# EAGLE design Croduino Nova (EAGLE 7.3.0)
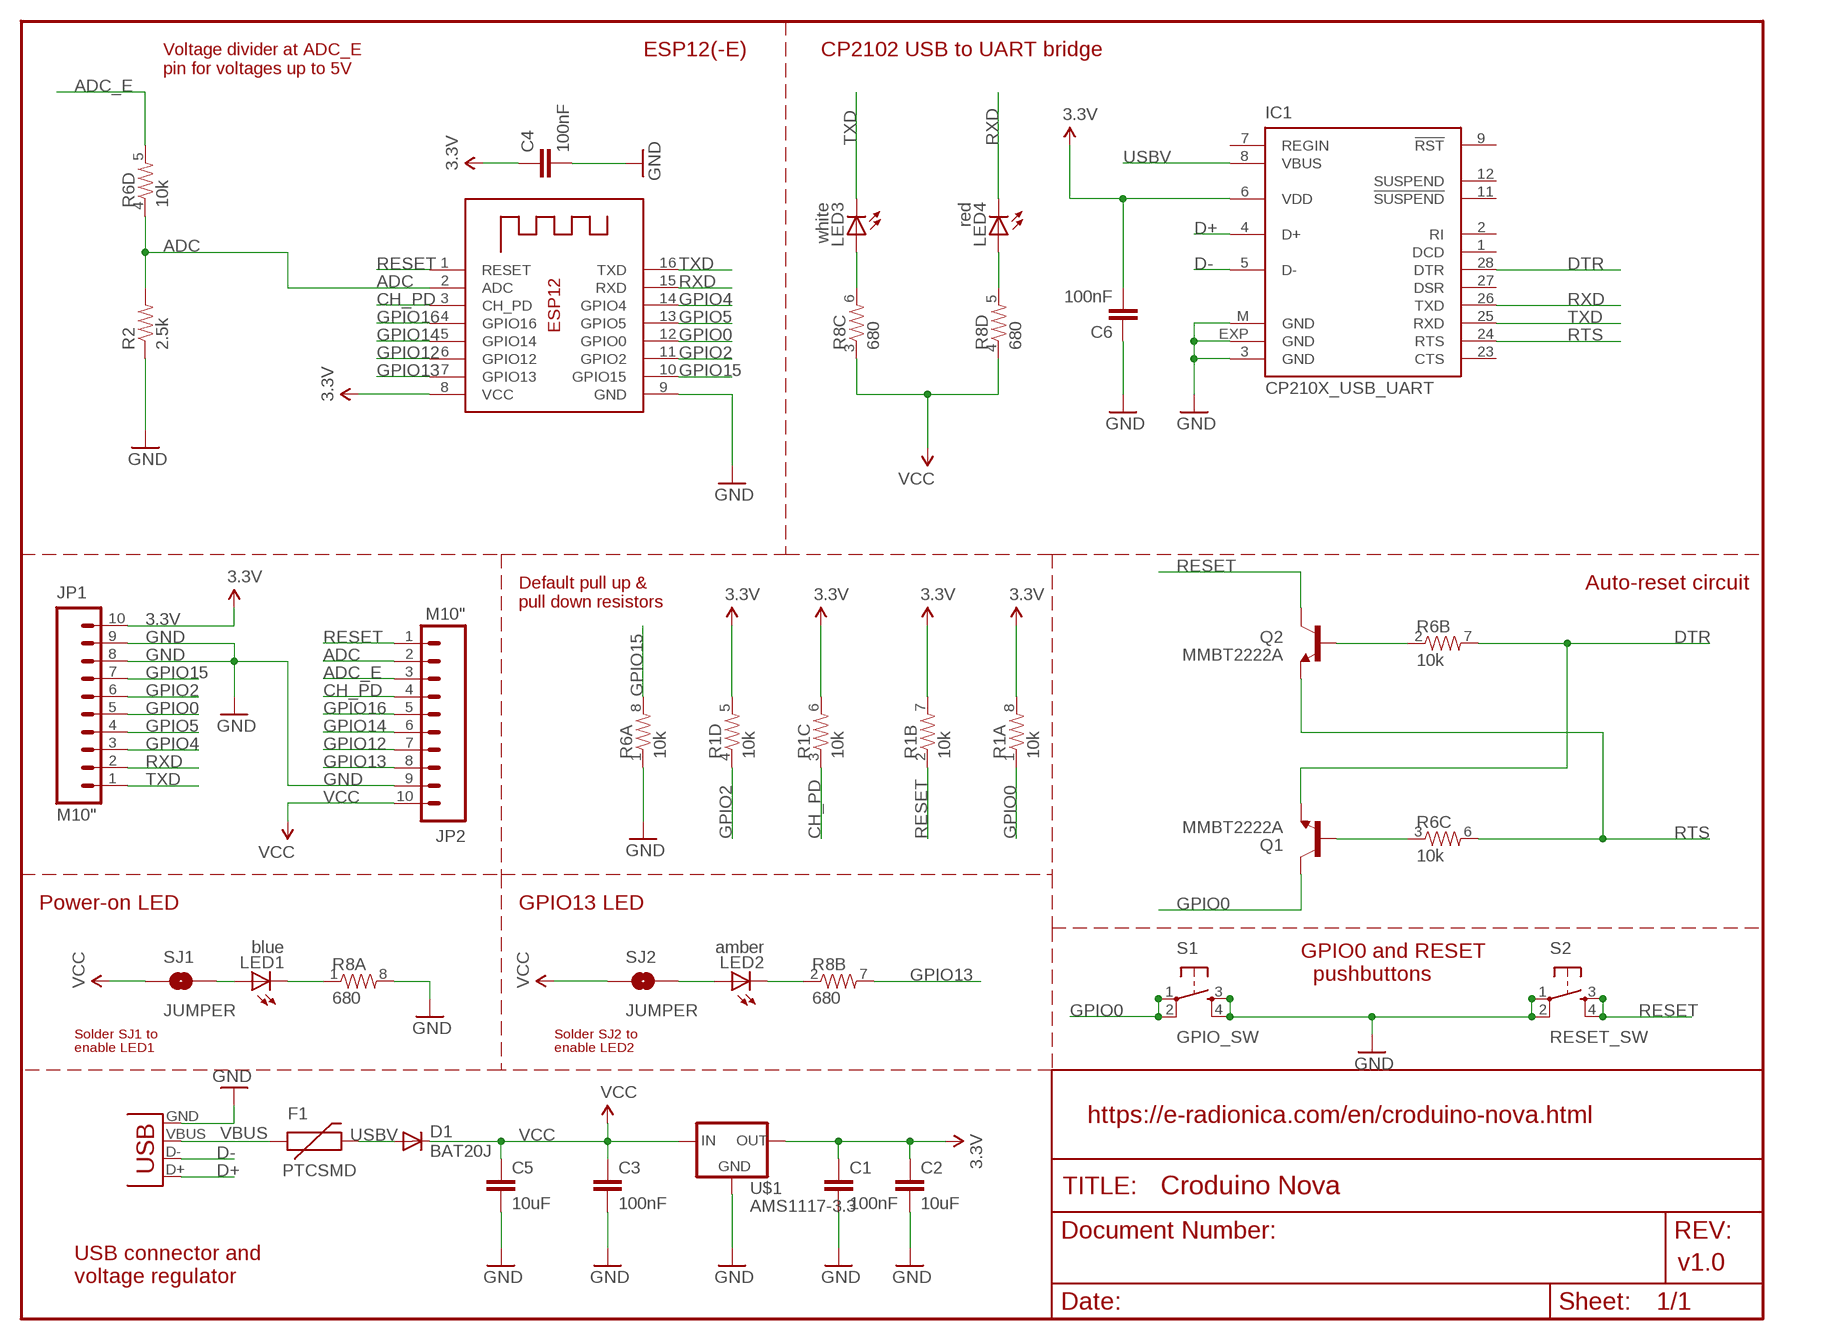
[diagram p0: schematic, sheet 1]

## Parts
C1  100nF  CAP0603-CAP  [0603-CAP]
C2  10uF  CAP1206  [1206]
C3  100nF  CAP0603-CAP  [0603-CAP]
C4  100nF  CAP0603-CAP  [0603-CAP]
C5  10uF  CAP1206  [1206]
C6  100nF  CAP0603-CAP  [0603-CAP]
D1  BAT20J  DIODESOD  [SOD-323]
F1  PTCSMD  [PTC-1206]
IC1  CP210X_USB_UART  [MLP28]
JP1  M10"  [1X10]
JP2  M10"  [1X10]
LED1  blue  LEDCHIP-LED0805  [CHIP-LED0805]
LED2  amber  LEDCHIP-LED0805  [CHIP-LED0805]
LED3  white  LEDCHIP-LED0805  [CHIP-LED0805]
LED4  red  LEDCHIP-LED0805  [CHIP-LED0805]
Q1  MMBT2222A  TRANSISTOR_NPNSOT23-3  [SOT23-3]
Q2  MMBT2222A  TRANSISTOR_NPNSOT23-3  [SOT23-3]
R1  10k  RESISTOR-ARRAY0603-ARV  [0603-ARV]
R2  2.5k  RESISTOR0603-RES  [0603-RES]
R6  10k  RESISTOR-ARRAY0603-ARV  [0603-ARV]
R8  680  RESISTOR-ARRAY0603-ARV  [0603-ARV]
S1  GPIO_SW  TAC_SWITCHSMD  [TACTILE_SWITCH_SMD]
S2  RESET_SW  TAC_SWITCHSMD  [TACTILE_SWITCH_SMD]
SJ1  JUMPER  SOLDERJUMPERNC  [SJ_2S]
SJ2  JUMPER  SOLDERJUMPERNC  [SJ_2S]
U$1  AMS1117-3.3  [SOT223]
X1  ESP8266-12  ESP-12  [ESP-12]
X2  USB-MICROB  [USB-MICROB]

## Nets
3.3V: C1.1 C2.1 C4.1 C6.2 IC1.6(VDD) JP1.10 R1.5 R1.6 R1.7 R1.8 U$1.4(OUT) X1.8(VCC)
ADC: JP2.2 R2.2 R6.4 X1.2(ADC)
ADC_E: JP2.3 R6.5
CH_PD: JP2.4 R1.3 X1.3(CH_PD)
D+: IC1.4(D+) X2.D+
D-: IC1.5(D-) X2.D-
DTR: IC1.28(DTR) Q1.2(E) R6.7
GND: C1.2 C2.2 C3.2 C4.2 C5.2 C6.1 IC1.3(GND) IC1.EXP(GND) IC1.M(GND) JP1.8 JP1.9 JP2.9 R2.1 R6.1 R8.8 S1.3 S1.4 S2.1 S2.2 U$1.1(ADJ) X1.9(GND) X2.GND
GPIO0: JP1.5 Q1.3(C) R1.1 S1.1 S1.2 X1.12(GPIO0)
GPIO2: JP1.6 R1.4 X1.11(GPIO2)
GPIO4: JP1.3 X1.14(GPIO4)
GPIO5: JP1.4 X1.13(GPIO5)
GPIO12: JP2.7 X1.6(GPIO12)
GPIO13: JP2.8 R8.7 X1.7(GPIO13)
GPIO14: JP2.6 X1.5(GPIO14)
GPIO15: JP1.7 R6.8 X1.10(GPIO15)
GPIO16: JP2.5 X1.4(GPIO16)
N$1: LED3.A R8.6
N$2: LED1.A SJ1.2
N$3: LED1.C R8.1
N$4: LED4.A R8.5
N$6: LED2.A SJ2.2
N$7: LED2.C R8.2
N$8: Q1.1(B) R6.3
N$11: Q2.1(B) R6.2
RESET: JP2.1 Q2.3(C) R1.2 S2.3 S2.4 X1.1(RESET)
RTS: IC1.24(RTS) Q2.2(E) R6.6
RXD: IC1.26(TXD) JP1.2 LED4.C X1.15(RXD)
TXD: IC1.25(RXD) JP1.1 LED3.C X1.16(TXD)
USBV: D1.2(A) F1.2 IC1.8(VBUS)
VBUS: F1.1 X2.VBUS
VCC: C3.1 C5.1 D1.1(C) JP2.10 R8.3 R8.4 SJ1.1 SJ2.1 U$1.3(IN)
Unconnected: IC1.1(DCD) IC1.2(RI) IC1.7(REGIN) IC1.9(!RST) IC1.11(!SUSPEND) IC1.12(SUSPEND) IC1.23(CTS) IC1.27(DSR)

## Notes on the sheet
- ESP12(-E) | CP2102 USB to UART bridge
- Voltage divider at ADC_E
  pin for voltages up to 5V
- Auto-reset circuit
- Default pull up &
  pull down resistors
- Power-on LED | GPIO13 LED
- GPIO0 and RESET
    pushbuttons
- Solder SJ1 to 
  enable LED1
- Solder SJ2 to
  enable LED2
- https://e-radionica.com/en/croduino-nova.html
- v1.0
- USB connector and 
  voltage regulator

## Library data of the parts
C1-C6 = SparkFun:CAP: Capacitor Standard 0603 ceramic capacitor, and 0.1" leaded capacitor.
D1 = SparkFun:DIODE: Diode These are standard reverse protection diodes and small signal diodes. SMA package can handle up to about 1A. SOD-323 can handle about 200mA. What the SOD-323 package when ordering, there are some mfgs out there that are 5-pin packages.
F1 = SparkFun:PTC: Resettable Fuse PTC Resettable Fuse. Spark Fun Electronics SKU : COM-08357
IC1 = SparkFun:CP210X_USB_UART: Single-Chip USB to UART Bridge Source: www.silabs.com .. CP2101.pdf / cp2102.pdf. Spark Fun Electronics SKU : COM-00310
JP1 JP2 = SparkFun:M10: Header 10 Standard 10-pin 0.1" header. Use with straight break away headers (SKU : PRT-00116), right angle break away headers (PRT-00553), swiss pins (PRT-00743), machine pins (PRT-00117), and female headers (PRT-00115).
LED1-LED4 = adafruit:LED: LED OSRAM: - CHIPLED LG R971, LG N971, LY N971, LG Q971, LY Q971, LO R971, LY R971 LH N974, LH R974 LS Q976, LO Q976, LY Q976 LO Q996 - Hyper CHIPLED LW Q18S LB Q993, LB Q99A, LB R99A - SideLED LS A670, LO A670, LY A670, LG A670, LP A670 LB A673, LV A673, LT A673, LW A673 LH A674 LY A675 LS A676, LA A676, LO A676, LY A676, LW A676 LS A679, LY A679, LG A679 - Hyper Micro SIDELED® LS Y876, LA Y876, LO Y876, LY Y876 LT Y87S - SmartLED LW L88C, LW L88S LB L89C, LB L89S, LG L890 LS L89K, LO L89K, LY L89K LS L896, LA L896, LO L896, LY L896 - TOPLED LS T670, LO T670, LY T670, LG T670, LP T670 LSG T670, LSP T670, LSY T670, LOP T670, LYG T670 LG T671, LOG T671, LSG T671 LB T673, LV T673, LT T673, LW T673 LH T674 LS T676, LA T676, LO T676, LY T676, LB T676, LH T676, LSB T676, LW T676 LB T67C, LV T67C, LT T67C, LS T67K, LO T67K, LY T67K, LW E67C LS E67B, LA E67B, LO E67B, LY E67B, LB E67C, LV E67C, LT E67C LW T67C LS T679, LY T679, LG T679 LS T770, LO T770, LY T770, LG T770, LP T770 LB T773, LV T773, LT T773, LW T773 LH T774 LS E675, LA E675, LY E675, LS T675 LS T776, LA T776, LO T776, LY T776, LB T776 LHGB T686 LT T68C, LB T68C - Hyper Mini TOPLED® LB M676 - Mini TOPLED Santana® LG M470 LS M47K, LO M47K, LY M47K Source: http://www.osram.convergy.de/
Q1 Q2 = SparkFun:TRANSISTOR_NPN: Transistor NPN BJT configuration in SOT23 package. MMBT2222 is the common NPN we use. Double check BCE configuration again layout.
R1 R6 R8 = SparkFun:RESISTOR-ARRAY: Array Chip Resistor Source: RS Component / Phycomp
R2 = SparkFun:RESISTOR: Resistor Basic schematic elements and footprints for 0603, 1206, and PTH resistors.
S1 S2 = SparkFun:TAC_SWITCH: Momentary Switch Button commonly used for reset or general input. Spark Fun Electronics SKU : COM-00097
SJ1 SJ2 = SparkFun:SOLDERJUMPER: Solder Jumper Standard SMD solder jumper. Used to automate production. Two varients : Normally Open and Normally Closed are the same, but have different paste layers. NC will have a large amount of paste and should jumper during reflow.
U$1 = SparkFun:AMS1117-3.3
X1 = adafruit:ESP-12
X2 = SparkFun:USB: USB Connectors USB-B-PTH is fully proven SKU : PRT-00139 USB-miniB is fully proven SKU : PRT-00587 USB-A-PCB is untested. USB-A-H is throughly reviewed, but untested. Spark Fun Electronics SKU : PRT-00437 USB-B-SMT is throughly reviewed, but untested. Needs silkscreen touching up. USB-A-S has not been used/tested USB-MB-H has not been used/tested

## Board
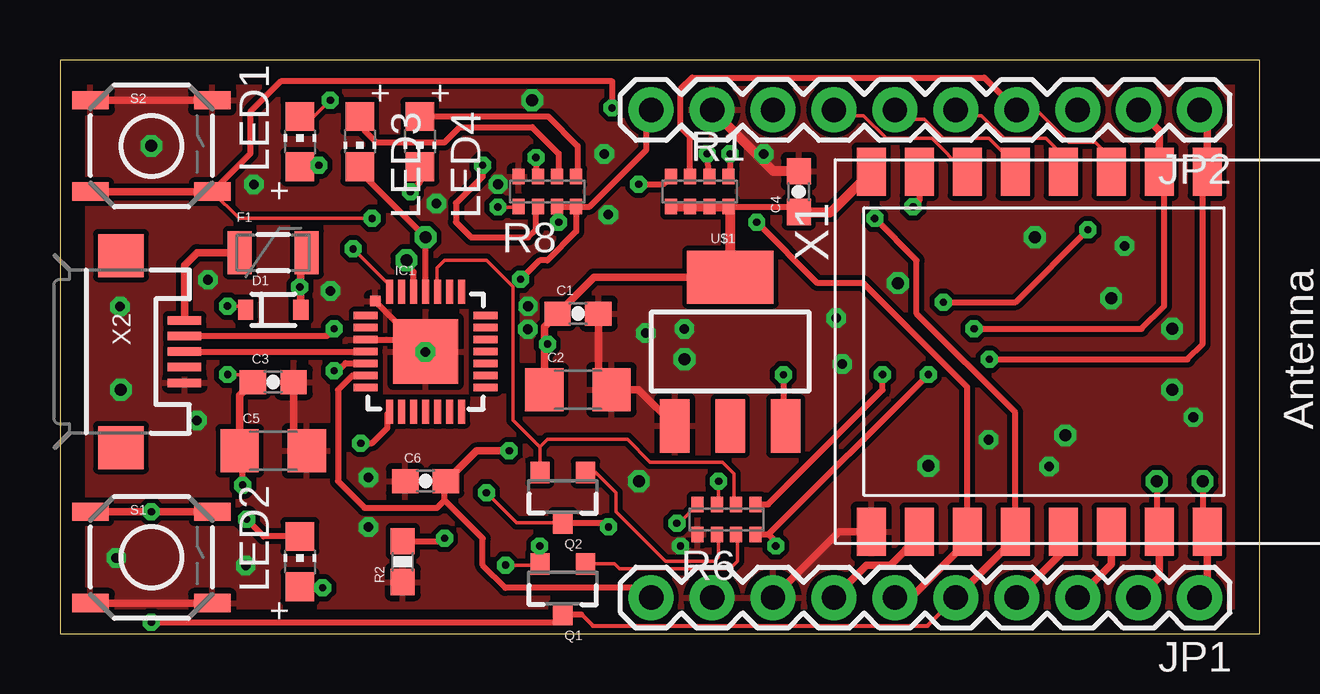
[diagram p1: board, top side]
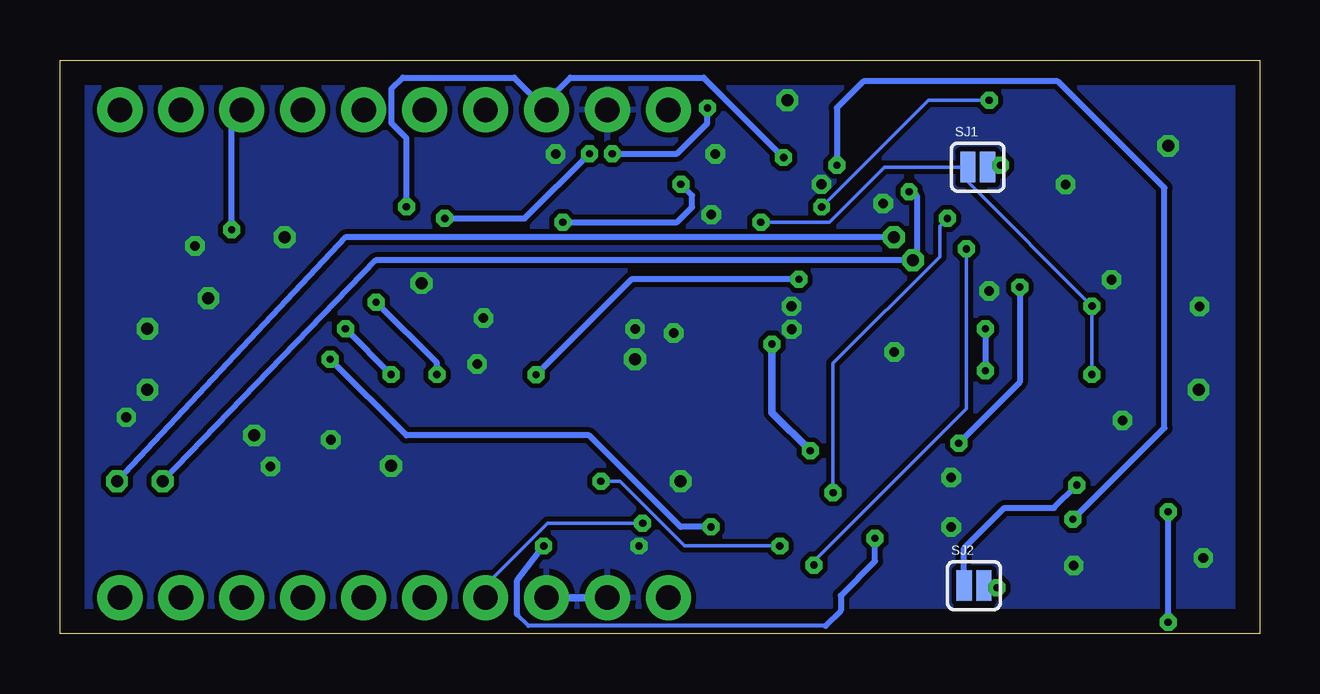
[diagram p2: board, bottom side, seen from below]

Size 50 x 23.9 mm. Coordinates in mm from the lower left corner, seen from the top.
Outline: 0,0 50,0 50,23.9 0,23.9 0,0
Copper layers (1*16): Top 0.035mm / dielectric 1.5mm / Bottom 0.035mm
Design rules "default *": minimum track width 10mil, minimum drill 24mil, track to track 8mil, track to pad 8mil, pad to pad 8mil, via to via 8mil, smd to smd 8mil, copper to edge 40mil, drill to drill 8mil, minimum pad ring 10mil, minimum via ring 8mil, stop-mask expansion 4mil, vias tented up to drill 5mm, thermal gap 10mil

### Footprints (pad centres in the part's own frame; a part is rotated, then mirrored left to right if it is on the bottom)
0603-CAP = smd 1.1 x 1: 1 -0.85,0; 2 0.85,0
1206 = smd 1.6 x 1.8: 1 -1.4,0; 2 1.4,0
SOD-323 = smd 0.63 x 0.83: 1 -1.15,0; 2 1.15,0
PTC-1206 = smd 1 x 1.8: 1 -1.4,0; 2 1.4,0
MLP28 = smd 1 x 0.3: 1 -2.5,1.5; 2 -2.5,1; 3 -2.5,0.5; 4 -2.5,0; 5 -2.5,-0.5; 6 -2.5,-1; 7 -2.5,-1.5; 15 2.5,-1.5; 16 2.5,-1; 17 2.5,-0.5; 18 2.5,0; 19 2.5,0.5; 20 2.5,1; 21 2.5,1.5 | smd 0.3 x 1: 8 -1.5,-2.5; 9 -1,-2.5; 10 -0.5,-2.5; 11 0,-2.5; 12 0.5,-2.5; 13 1,-2.5; 14 1.5,-2.5; 22 1.5,2.5; 23 1,2.5; 24 0.5,2.5; 25 0,2.5; 26 -0.5,2.5; 27 -1,2.5; 28 -1.5,2.5 | smd 2.7 x 2.7: EXP 0,0 | smd 0.435 x 0.435: M -2.103,2.103
1X10 = drill 1.016 pad 1.88: 1 0,0; 2 2.54,0; 3 5.08,0; 4 7.62,0; 5 10.16,0; 6 12.7,0; 7 15.24,0; 8 17.78,0; 9 20.32,0; 10 22.86,0
CHIP-LED0805 = smd 1.2 x 1.2: A 0,-1.05; C 0,1.05
SOT23-3 = smd 0.8 x 0.9: 1 -0.95,-1; 2 0.95,-1; 3 0,1.1
0603-ARV = smd 0.5 x 0.65: 1 -1.2,-0.625; 2 -0.4,-0.625; 3 0.4,-0.625; 4 1.2,-0.625; 5 1.2,0.625; 6 0.4,0.625; 7 -0.4,0.625; 8 -1.2,0.625
0603-RES = smd 1.1 x 1: 1 -0.85,0; 2 0.85,0
TACTILE_SWITCH_SMD = smd 1.524 x 0.762: 1 -2.54,1.905; 2 2.54,1.905; 3 -2.54,-1.905; 4 2.54,-1.905
SJ_2S = smd 0.635 x 1.27: 1 -0.412,0; 2 0.412,0
SOT223 = smd 1.219 x 2.235: 1 -2.311,-3.099; 2 0,-3.099; 3 2.311,-3.099 | smd 3.6 x 2.2: 4 0,3.099
ESP-12 = smd 2 x 1.2: 1 -7.5,4.5; 2 -7.5,2.5; 3 -7.5,0.5; 4 -7.5,-1.5; 5 -7.5,-3.5; 6 -7.5,-5.5; 7 -7.5,-7.5; 8 -7.5,-9.5; 9 7.5,-9.5; 10 7.5,-7.5; 11 7.5,-5.5; 12 7.5,-3.5; 13 7.5,-1.5; 14 7.5,0.5; 15 7.5,2.5; 16 7.5,4.5
USB-MICROB = smd 0.35 x 1.4: D+ 0,2.65; D- -0.65,2.65; GND 1.3,2.65; ID 0.65,2.65; VBUS -1.3,2.65 | smd 1.8 x 1.9: MT1 -4,0; MT2 4,0

### Placement (x,y rotation side)
C1  21.59,13.34 0 top
C2  21.59,10.16 0 top
C3  8.89,10.48 0 top
C4  30.8,18.41 90 top
C5  8.89,7.62 0 top
C6  15.24,6.35 0 top
D1  8.89,13.49 0 top
F1  8.89,15.88 0 top
IC1  15.24,11.75 0 top
JP1  47.5,1.5 180 top
JP2  47.5,21.82 180 top
LED1  10,20.5 0 top
LED2  10,3 0 top
LED3  12.5,20.5 180 top
LED4  15,20.5 180 top
Q1  20.95,1.91 180 top
Q2  20.95,5.71 180 top
R1  26.67,18.41 180 top
R2  14.29,3 90 top
R6  27.78,4.76 0 top
R8  20.32,18.41 0 top
S1  3.81,3.17 0 top
S2  3.81,20.32 0 top
SJ1  11.75,19.44 0 bottom
SJ2  11.9,2 0 bottom
U$1  27.94,11.75 0 top
U$2  [CRODUINO_NOVA]  0,0 0 top
U$3  [NOVI_LOGO-4MM]  21.42,14.12 0 top
U$4  [OSH3MM]  15.39,2.22 0 top
X1  43.32,11.75 270 top
X2  2.54,11.75 270 top

### Tracks (layer width: path | path; a pad name or v marks a point on that pad's centre or on a via)
3.3V  (via drill 0.3)
  Top 0.254: R1.8 30.57,17.79 | IC1.6 12.18,10.75 11.59,10.16 11.59,6.35 12.7,5.24 15.71,5.24 16.03,5.55 | 16.03,6.41 C6.2 16.03,6.29 16.03,5.55 | JP1.10 24.23,1.91 18.57,1.91 17.62,2.86 17.62,3.97 16.03,5.55
  Top 0.305: U$1.4 22.25,14.85 C1.1 20.19,12.79 C2.1 20.19,11.94 v20.32,12.06 | v18.73,7.62 17.36,7.62 C6.2
  Top 0.406: U$1.4 27.94,17.72 R1.8 R1.7 R1.6 R1.5 | 30.57,17.79 C4.1 32.13,17.57 X1.8
  Bottom 0.305: v20.32,12.06 20.32,9.21 v18.73,7.62
ADC  (via drill 0.3)
  Top 0.254: R6.4 29.54,4.14 | 29.54,4.14 v36.2,10.79 | v38.1,12.7 45.08,12.7 46.02,13.65 46.02,19.04 X1.2 | 14.01,3.85 R2.2 15.91,3.85 v16.03,3.97 | v29.84,3.65 29.99,3.68 29.54,4.14
  Top 0.305: X1.2 45.82,20.96 JP2.2
  Bottom 0.17: 18.09,0.32 30.47,0.32 30.95,0.79
  Bottom 0.254: v36.2,10.79 v38.1,12.7 | 30.95,0.79 30.95,2.22 v29.84,3.65 | v16.03,3.97 16.03,3.02 17.46,1.59 17.46,0.95 18.09,0.32
ADC_E  (via drill 0.3)
  Top 0.254: R6.5 29.52,5.39 34.29,10.16 v34.29,10.79 | v36.82,13.81 39.83,13.81 v42.85,16.82
  Bottom 0.254: v34.29,10.79 34.29,11.28 v36.82,13.81 | v42.85,16.82 42.85,21.39 JP2.3
CH_PD
  Top 0.15: X1.3 43.82,19.82 43.17,20.47 42.06,20.47 40.79,21.74 39.96,21.74 JP2.4
  Top 0.254: R1.3 26.27,20.7 25.87,21.11 25.87,22.69 26.34,23.17 38.53,23.17 JP2.4
D+
  Top 0.254: X2.D+ IC1.4
D-  (via drill 0.3)
  Top 0.254: X2.D- 11.13,12.4 v11.43,12.7 | v11.43,10.95 11.59,10.95 11.9,11.27 12.72,11.27 IC1.5
  Bottom 0.254: v11.43,12.7 v11.43,10.95
DTR  (via drill 0.3)
  Top 0.15: v18.57,2.86 19.96,2.86 Q1.2 v20,3.64 v20,3.65 | v27.45,6.35 27.45,5.46 R6.7 | IC1.28 13.74,14.51 v12.22,16.03
  Bottom 0.15: v18.57,2.86 18.57,3.02 12.22,9.36 v12.22,16.03 | v20,3.65 23.96,3.65 26.66,6.35 v27.45,6.35
GND  (via drill 0.3, 0.4, 0.5)
  Top 0.15: IC1.M | 14.28,12.7 14.61,12.7 15.24,12.06 15.24,11.43 14.61,12.06
  Top 0.254: IC1.3 14.74,12.25 IC1.EXP | IC1.M 14.28,12.7
  Top 0.305: X1.9 32.47,4.25 JP1.8 | S1.3 S1.4 | S2.1 S2.2 | C3.2 9.74,8.17 C5.2 | C1.2 22.44,10.71 C2.2 24.12,10.16 U$1.1
  Top 0.406: C4.2 29.73,19.27 JP2.9
  Bottom 0.305: JP1.8 JP1.9
  other vias: 2.54,10.16 3.81,20.32 19.68,22.23 41.91,8.26 46.35,10.16 43.81,13.97 40.64,16.51 34.92,14.61 36.2,6.99 24.13,6.35 46.35,12.7 26.04,11.43 26.03,12.7 15.23,11.74 5.71,8.89 12.86,6.5 12.86,4.44 11.28,14.28 18.26,18.72 22.85,17.45 22.68,19.99 8.08,18.72 6.17,14.74 24.42,12.52 32.35,13.15 41.22,6.96 47.24,9.02 44.37,16.15 32.61,11.23 19.51,13.64 19.5,12.68 15.69,17.92 38.7,8.08 7.74,2.84 2.34,3.15 2.5,13.63 29.34,19.98 25.87,3.65
  pour Top: 0,0 49.99,0 49.99,23.49 0,23.49
  pour Bottom: 0,0 49.99,0 49.99,23.49 0,23.49
GPIO0  (via drill 0.3)
  Top 0.17: 20.79,0.48 Q1.3 | 21.73,0.81 22.22,0.32 36.16,0.32 JP1.5
  Top 0.254: 21.73,0.81 Q1.3 20.95,0.48 v3.81,0.48 | X1.12 39.82,9.22 35.71,13.33 35.71,15.55 v33.96,17.3 | v27.93,20 27.93,19.1 R1.1
  Top 0.305: X1.12 39.82,3.98 JP1.5 | S1.1 v3.81,5.08 S1.2
  Bottom 0.254: v3.81,0.48 3.81,4.44 v3.81,5.08 | v33.96,17.3 30.63,17.3 v27.93,20
GPIO2  (via drill 0.3)
  Top 0.254: X1.11 37.82,10.27 33.49,14.6 31.58,14.6 v29.04,17.14 | v24.12,18.73 25.16,18.73 R1.4
  Top 0.305: X1.11 37.82,3.85 35.56,1.59 34.89,1.59 JP1.6
  Bottom 0.254: v29.04,17.14 24.28,17.14 23.65,17.77 23.65,18.25 v24.12,18.73
GPIO4
  Top 0.305: X1.14 43.82,2.9 JP1.3
GPIO5
  Top 0.305: X1.13 41.82,3.44 JP1.4
GPIO12
  Top 0.15: X1.6 37.73,19.25 36.34,20.63 34.44,20.63 33.49,21.58 32.5,21.58 JP2.7
GPIO13  (via drill 0.3)
  Top 0.254: X1.7 35.82,18.04 v35.56,17.78 | v19.84,19.84 19.84,19.12 R8.7
  Bottom 0.254: v35.56,17.78 35.56,20.64 36.18,21.27 36.18,22.69 35.71,23.17 31.07,23.17 JP2.8 29.72,22.18 28.73,23.17 23.17,23.17 v19.84,19.84
GPIO14
  Top 0.15: X1.5 39.82,19.54 38.72,20.63 36.82,20.63 36.02,21.42 35.2,21.42 JP2.6
GPIO15  (via drill 0.3)
  Top 0.15: v25.71,4.6 25.8,4.6 R6.8
  Top 0.305: X1.10 35.82,4.07 34.61,2.86 33.62,2.86 JP1.7
  Bottom 0.15: JP1.7 32.26,2.02 29.68,4.6 v25.71,4.6
GPIO16
  Top 0.15: X1.4 41.82,19.92 41.1,20.63 39.36,20.63 38.41,21.58 37.58,21.58 JP2.5
N$1
  Top 0.254: LED3.A 12.73,21.55 12.73,20.98 12.7,20.95 12.7,20.94 13.17,20.47 16.03,20.47 16.66,21.11 19.68,21.11 20.79,20 20.79,19.11 R8.6
N$2  (via drill 0.3)
  Top 0.254: LED1.A 10.72,19.45 v10.79,19.52
  Bottom 0.254: v10.79,19.52 11.25,19.52 SJ1.2
N$3  (via drill 0.3)
  Top 0.15: LED1.C 10.6,21.55 v11.27,22.22 | v18.25,17.77 19.1,17.77 R8.1
  Bottom 0.15: v11.27,22.22 13.81,22.22 v18.25,17.77
N$4
  Top 0.254: LED4.A 20.35,21.55 21.58,20.31 21.58,19.1 R8.5
N$6  (via drill 0.3)
  Top 0.254: LED2.A 10.9,1.95 v10.95,1.9
  Bottom 0.254: v10.95,1.9 11.4,1.9 SJ2.2
N$7  (via drill 0.3)
  Top 0.254: LED2.C 8.49,4.05 v7.78,4.76 | v17.62,19.52 17.62,19.04 16.5,17.93 16.5,17.14 17.14,16.5 19.52,16.5 19.84,16.82 19.84,17.71 R8.2
  Bottom 0.254: v7.78,4.76 3.97,8.57 3.97,18.57 8.41,23.01 16.5,23.01 17.62,21.9 v17.62,19.52
N$8
  Top 0.15: 28.09,4.05 R6.3 28.25,4.07 28.25,3.02 27.93,2.7 23.33,2.7 23.12,2.9 Q1.1
N$11
  Top 0.15: 22.33,6.71 Q2.1 21.95,6.67 22.38,6.67 23.17,5.87 23.17,5.08 25.23,3.02 27.3,3.02 27.45,3.17 27.45,4.06 R6.2
RESET  (via drill 0.3)
  Top 0.15: Q2.3 19.03,4.62 v17.77,5.87 | v13.01,17.3 7.47,17.3 S2.4
  Top 0.254: Q2.3 22.69,4.62 v22.86,4.45 | v38.73,11.43 46.99,11.43 47.62,12.06 47.62,19.05 X1.1 | R1.2 v26.98,20 | S2.4 7.93,20 7.93,21.74 9.21,23.01 23.01,23.01 v23.01,21.9
  Top 0.305: X1.1 47.82,21.5 JP2.1 | S2.3 S2.4
  Bottom 0.15: v17.77,5.87 17.77,11.27 13.33,15.71 13.33,16.98 v13.01,17.3
  Bottom 0.254: v22.86,4.45 24.13,4.45 27.94,8.26 35.56,8.26 v38.73,11.43 | v26.98,20 24.28,20 23.01,21.27 v23.01,21.9
RTS
  Top 0.15: IC1.24 15.71,14.28 15.71,15.23 16.03,15.55 17.77,15.55 18.89,14.44 18.89,8.89 20,7.77 Q2.2 20,7.79 20.31,8.09 23.65,8.09 24.6,7.14 27.61,7.14 28.09,6.67 28.09,5.48 R6.6
RXD  (via drill 0.3, 0.5)
  Top 0.254: IC1.26 14.74,15.06 v14.44,15.55 | v45.72,6.35 45.72,4.34 X1.15 | LED4.C 15,18.81 v14.61,18.41
  Top 0.305: X1.15 45.82,2.36 JP1.2
  Bottom 0.254: v45.72,6.35 36.84,15.55 v14.44,15.55 14.28,15.71 14.28,18.25 14.45,18.41 v14.61,18.41
TXD  (via drill 0.5)
  Top 0.254: IC1.25 v15.24,16.51 12.5,19.25 LED3.C | v47.62,6.35 47.62,4.44 X1.16
  Top 0.305: X1.16 47.82,1.82 JP1.1
  Bottom 0.254: v15.24,16.51 38.1,16.51 v47.62,6.35
USBV  (via drill 0.3)
  Top 0.254: D1.2 10.04,14.4 v10,14.44 | IC1.8 13.65,9.16 13.65,8.57 13.01,7.93 v12.54,7.93
  Top 0.305: D1.2 10.04,15.62 F1.2
  Bottom 0.254: v10,14.44 10,10.47 v12.54,7.93
VBUS
  Top 0.305: X2.VBUS 5.19,15.35 5.71,15.88 F1.1
VCC  (via drill 0.3)
  Top 0.15: 7.74,10.78 7,10.78 v6.99,10.79 | v6.98,13.65 7.58,13.65 D1.1 | v20.79,17.14 20.79,17.72 R8.3
  Top 0.254: R8.3 R8.4 | v7.62,6.19 7.62,7.49 C5.1 | v30.15,10.79 30.15,8.75 U$1.3 | R8.4 22.07,17.79 24.44,20.16 24.44,21.62 JP2.10 | R8.4 21.52,16.76 20.31,15.55 20,15.55 v19.2,14.76
  Top 0.305: 7.74,10.78 C3.1 7.49,9.93 C5.1
  Bottom 0.15: v6.99,10.79 v6.99,13.65 v6.98,13.65 12.16,18.82 SJ1.1 15.64,19.44 17.93,17.14 v20.79,17.14
  Bottom 0.254: SJ2.1 12.32,3.55 10.63,5.24 8.57,5.24 v7.62,6.19 | v19.2,14.76 26.19,14.76 v30.15,10.79

### Text on the board
200bmp: pwr | tx | rx | 5V | gnd | #13 | #12 | #14 | #16 | EN | A_e | A | rst | -- | -- | -- | RESET | rev v1.1 | Croduino Nova / e-radionica.com / Apr 2016 | * | v1.1., REV A | GPIO0 | ESP12-E | -- | 3V3 | gnd | gnd | #15 | #2 | #0 | #5 | #4 | rx | tx | #13 LED